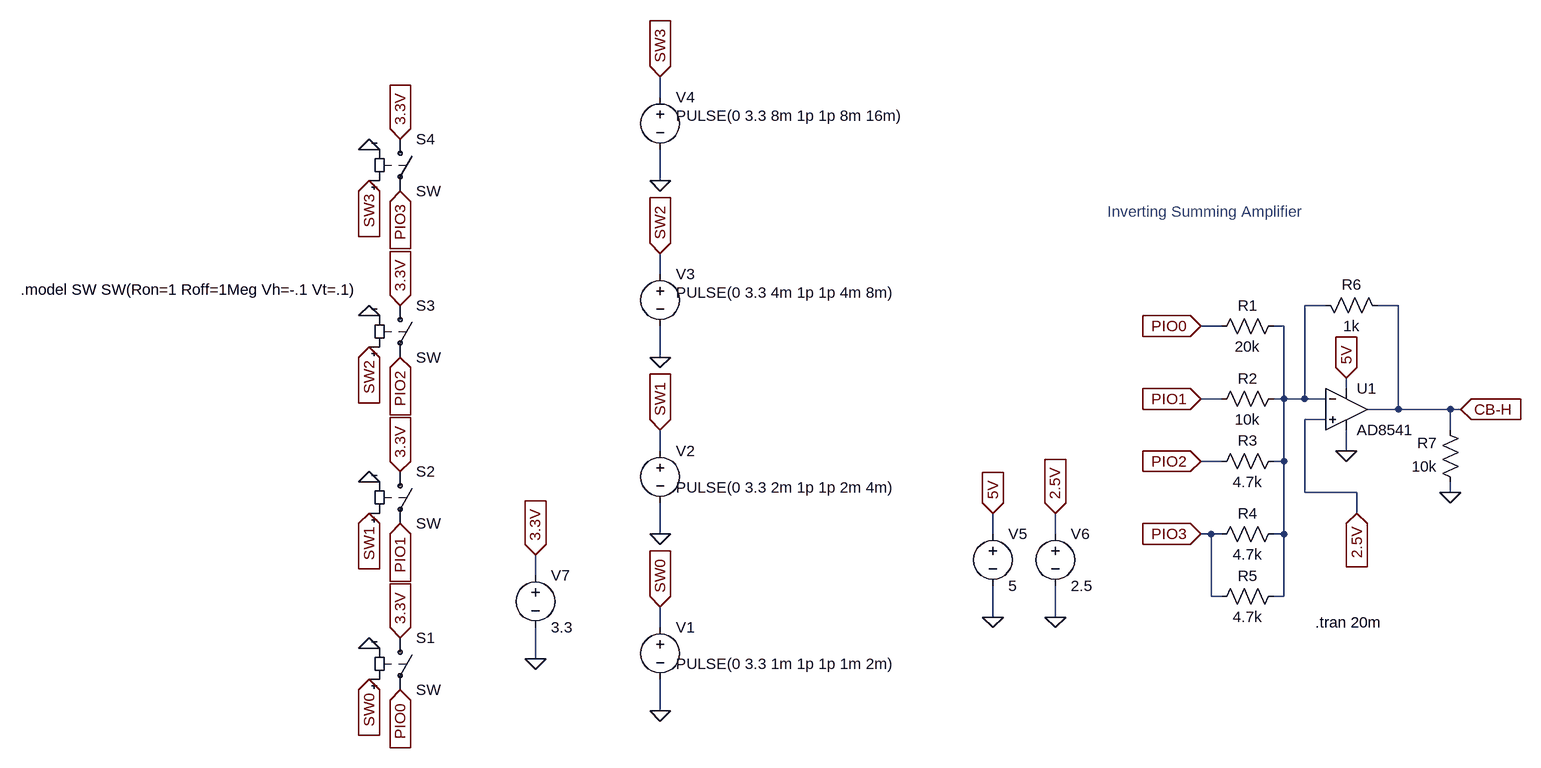
[diagram p0: schematic summing_amplifier.asc]
summing_amplifier.asc, the LTspice schematic file:
Version 4
SHEET 1 880 752
WIRE -672 -272 -672 -304
WIRE -672 -144 -672 -192
WIRE -672 0 -672 -32
WIRE 352 48 320 48
WIRE 464 48 432 48
WIRE 192 80 160 80
WIRE 288 80 272 80
WIRE -672 128 -672 80
WIRE 384 176 384 160
WIRE 192 192 160 192
WIRE 288 192 288 80
WIRE 288 192 272 192
WIRE 320 192 320 48
WIRE 320 192 288 192
WIRE 352 192 320 192
WIRE 464 208 464 48
WIRE 464 208 416 208
WIRE 544 208 464 208
WIRE 560 208 544 208
WIRE 352 224 320 224
WIRE 544 240 544 208
WIRE -672 272 -672 240
WIRE 384 272 384 240
WIRE 192 288 160 288
WIRE 288 288 288 192
WIRE 288 288 272 288
WIRE 320 336 320 224
WIRE 400 336 320 336
WIRE 544 336 544 320
WIRE 400 368 400 336
WIRE -672 400 -672 352
WIRE -160 400 -160 368
WIRE -64 400 -64 368
WIRE 176 400 160 400
WIRE 192 400 176 400
WIRE 288 400 288 288
WIRE 288 400 272 400
WIRE -864 464 -864 432
WIRE 176 496 176 400
WIRE 192 496 176 496
WIRE 288 496 288 400
WIRE 288 496 272 496
WIRE -160 528 -160 480
WIRE -64 528 -64 480
WIRE -672 544 -672 512
WIRE -864 592 -864 544
WIRE -672 672 -672 624
FLAG -160 528 0
FLAG 160 192 PIO1
IOPIN 160 192 In
FLAG -160 368 5V
IOPIN -160 368 In
FLAG 400 368 2.5V
IOPIN 400 368 In
FLAG 384 272 0
FLAG -64 528 0
FLAG -64 368 2.5V
IOPIN -64 368 In
FLAG 384 160 5V
IOPIN 384 160 In
FLAG 560 208 CB-H
IOPIN 560 208 In
FLAG -672 672 0
FLAG -672 512 SW0
IOPIN -672 512 In
FLAG -672 400 0
FLAG -1120 112 SW2
IOPIN -1120 112 In
FLAG -672 128 0
FLAG -672 -32 SW2
IOPIN -672 -32 In
FLAG -672 -144 0
FLAG -672 -304 SW3
IOPIN -672 -304 In
FLAG 160 80 PIO0
IOPIN 160 80 In
FLAG 160 400 PIO3
IOPIN 160 400 In
FLAG 160 288 PIO2
IOPIN 160 288 In
FLAG 544 336 0
FLAG -1120 64 0
FLAG -1120 -192 0
FLAG -1120 320 0
FLAG -1120 576 0
FLAG -1120 -144 SW3
IOPIN -1120 -144 In
FLAG -672 240 SW1
IOPIN -672 240 In
FLAG -1120 368 SW1
IOPIN -1120 368 In
FLAG -1120 624 SW0
IOPIN -1120 624 In
FLAG -1072 640 PIO0
IOPIN -1072 640 In
FLAG -1072 384 PIO1
IOPIN -1072 384 In
FLAG -1072 128 PIO2
IOPIN -1072 128 In
FLAG -1072 -128 PIO3
IOPIN -1072 -128 In
FLAG -864 592 0
FLAG -864 432 3.3V
IOPIN -864 432 In
FLAG -1072 304 3.3V
IOPIN -1072 304 In
FLAG -1072 48 3.3V
IOPIN -1072 48 In
FLAG -1072 -208 3.3V
IOPIN -1072 -208 In
FLAG -1072 560 3.3V
IOPIN -1072 560 In
SYMBOL Opamps\\AD8541 384 144 R0
SYMATTR InstName U1
SYMBOL res 560 336 R180
WINDOW 0 36 76 Left 2
WINDOW 3 36 40 Left 2
SYMATTR InstName R7
SYMATTR Value 10k
SYMBOL res 288 176 R90
WINDOW 0 0 56 VBottom 2
WINDOW 3 32 56 VTop 2
SYMATTR InstName R2
SYMATTR Value 10k
SYMBOL voltage -160 384 R0
WINDOW 123 0 0 Left 0
WINDOW 39 0 0 Left 0
SYMATTR InstName V5
SYMATTR Value 5
SYMBOL voltage -64 384 R0
WINDOW 123 0 0 Left 0
WINDOW 39 0 0 Left 0
SYMATTR InstName V6
SYMATTR Value 2.5
SYMBOL res 336 32 M90
WINDOW 0 0 56 VBottom 2
WINDOW 3 32 56 VTop 2
SYMATTR InstName R6
SYMATTR Value 1k
SYMBOL voltage -672 528 R0
WINDOW 123 0 0 Left 0
WINDOW 39 24 44 Left 2
WINDOW 3 24 72 Left 2
SYMATTR Value PULSE(0 3.3 1m 1p 1p 1m 2m)
SYMATTR InstName V1
SYMBOL voltage -672 256 R0
WINDOW 123 0 0 Left 0
WINDOW 39 24 44 Left 2
WINDOW 3 24 72 Left 2
SYMATTR Value PULSE(0 3.3 2m 1p 1p 2m 4m)
SYMATTR InstName V2
SYMBOL voltage -672 -16 R0
WINDOW 123 0 0 Left 0
WINDOW 39 24 72 Left 2
WINDOW 3 24 44 Left 2
SYMATTR Value PULSE(0 3.3 4m 1p 1p 4m 8m)
SYMATTR InstName V3
SYMBOL voltage -672 -288 R0
WINDOW 123 0 0 Left 0
WINDOW 39 24 72 Left 2
WINDOW 3 24 44 Left 2
SYMATTR Value PULSE(0 3.3 8m 1p 1p 8m 16m)
SYMATTR InstName V4
SYMBOL res 288 64 R90
WINDOW 0 0 56 VBottom 2
WINDOW 3 32 56 VTop 2
SYMATTR InstName R1
SYMATTR Value 20k
SYMBOL res 288 384 R90
WINDOW 0 0 56 VBottom 2
WINDOW 3 32 56 VTop 2
SYMATTR InstName R4
SYMATTR Value 4.7k
SYMBOL res 288 272 R90
WINDOW 0 0 56 VBottom 2
WINDOW 3 32 56 VTop 2
SYMATTR InstName R3
SYMATTR Value 4.7k
SYMBOL res 288 480 R90
WINDOW 0 0 56 VBottom 2
WINDOW 3 32 56 VTop 2
SYMATTR InstName R5
SYMATTR Value 4.7k
SYMBOL sw -1072 -224 R0
SYMATTR InstName S4
SYMBOL sw -1072 32 R0
SYMATTR InstName S3
SYMBOL sw -1072 288 R0
SYMATTR InstName S2
SYMBOL sw -1072 544 R0
SYMATTR InstName S1
SYMBOL voltage -864 448 R0
WINDOW 123 0 0 Left 0
WINDOW 39 0 0 Left 0
SYMATTR InstName V7
SYMATTR Value 3.3
TEXT 336 536 Left 2 !.tran 20m
TEXT 16 -96 Left 2 ;Inverting Summing Amplifier
TEXT -1656 24 Left 2 !.model SW SW(Ron=1 Roff=1Meg Vh=-.1 Vt=.1)

The netlist it stands for:
* summing_amplifier.asc
XU1 2.5V N001 5V 0 CB-H AD8541  ; pins In+ In- V+ V- OUT
R7 0 CB-H 10k
R2 N001 PIO1 10k
V5 5V 0 5
V6 2.5V 0 2.5
R6 N001 CB-H 1k
V1 SW0 0 PULSE(0 3.3 1m 1p 1p 1m 2m)
V2 SW1 0 PULSE(0 3.3 2m 1p 1p 2m 4m)
V3 SW2 0 PULSE(0 3.3 4m 1p 1p 4m 8m)
V4 SW3 0 PULSE(0 3.3 8m 1p 1p 8m 16m)
R1 N001 PIO0 20k
R4 N001 PIO3 4.7k
R3 N001 PIO2 4.7k
R5 N001 PIO3 4.7k
S4 3.3V PIO3 SW3 0 SW
S3 3.3V PIO2 SW2 0 SW
S2 3.3V PIO1 SW1 0 SW
S1 3.3V PIO0 SW0 0 SW
V7 3.3V 0 3.3
.tran 20m
* Inverting Summing Amplifier
.model SW SW(Ron=1 Roff=1Meg Vh=-.1 Vt=.1)
.backanno
.end